# Altium schematic sheet Converter_Main_HV.SchDoc
size B; SheetNumber: 2; SheetTotal: 2
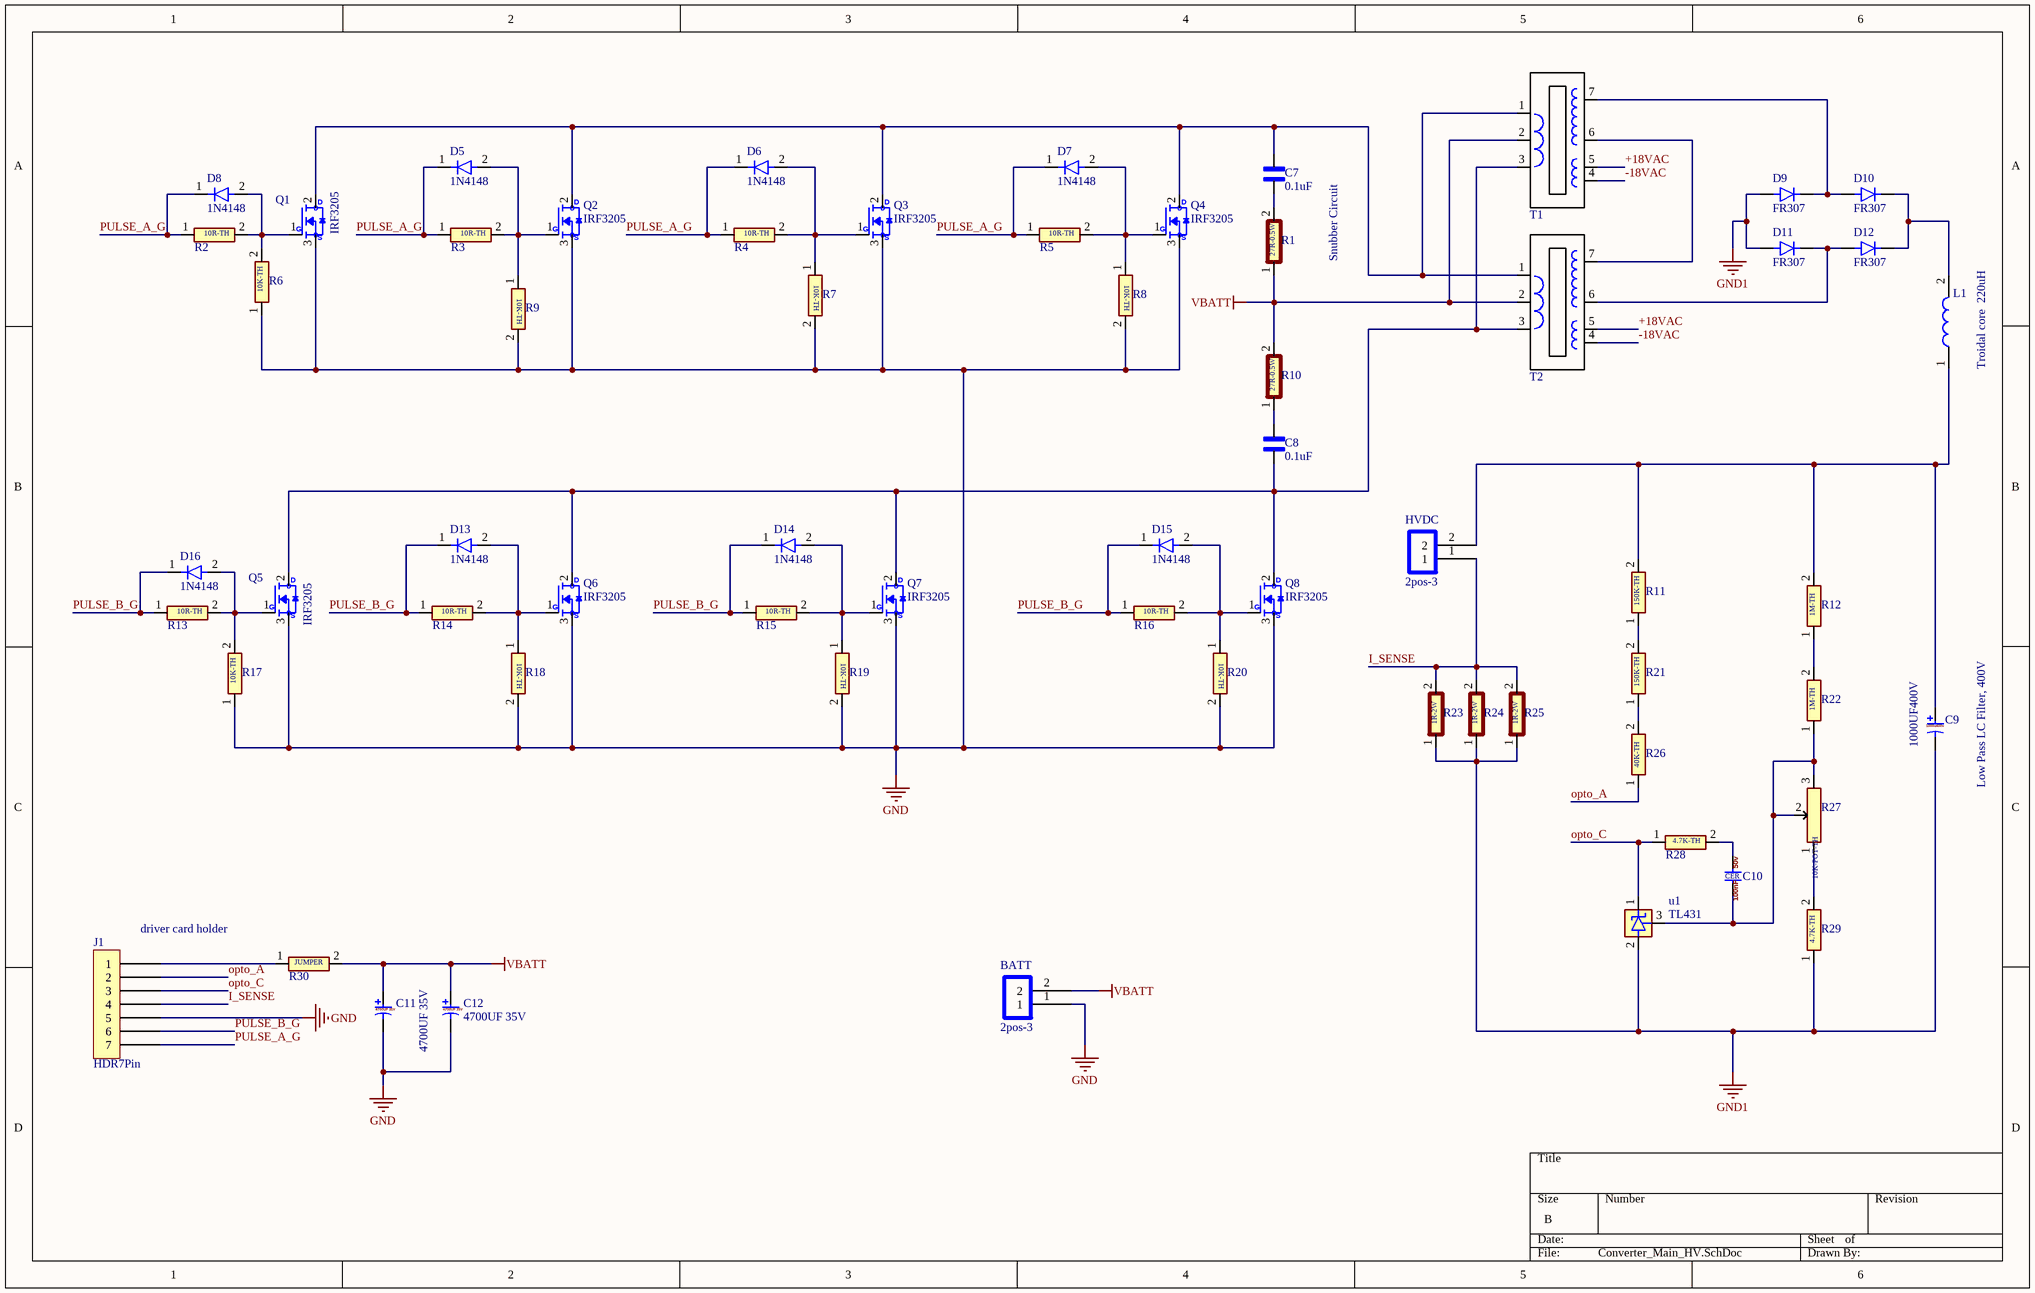
[diagram p0: Converter_Main_HV.SchDoc]

## Parts
BATT  2pos-3  [2POS - 3]
C7  0.1uF  [CAP-P_Pilm]
C8  0.1uF  [CAP-P_Pilm]
C9  1000UF400V  [CAP-TH_BD35.0-P10.00-D2.3-FD]
C10  100nFCER  [CAP-CER-2.54]  (value not drawn)
C11  4700UF 35V  [CAP-TH_BD18.0-P7.50-D1.2-FD]
C12  4700UF 35V  [CAP-TH_BD18.0-P7.50-D1.2-FD]
D5  1N4148  [DIOAD1036W78L470D235]
D6  1N4148  [DIOAD1036W78L470D235]
D7  1N4148  [DIOAD1036W78L470D235]
D8  1N4148  [DIOAD1036W78L470D235]
D9  FR307  [DO-27_BD5.3-L8.4-P12.40-D1.3-RD]
D10  FR307  [DO-27_BD5.3-L8.4-P12.40-D1.3-RD]
D11  FR307  [DO-27_BD5.3-L8.4-P12.40-D1.3-RD]
D12  FR307  [DO-27_BD5.3-L8.4-P12.40-D1.3-RD]
D13  1N4148  [DIOAD1036W78L470D235]
D14  1N4148  [DIOAD1036W78L470D235]
D15  1N4148  [DIOAD1036W78L470D235]
D16  1N4148  [DIOAD1036W78L470D235]
HVDC  2pos-3  [2POS - 3]
J1  HDR7Pin  [HDR-TH 7P - male hader]
L1  Troidal core  220uH  [TOROIDAL CORE INDUCTOR]
Q1  IRF3205  [TO-220]
Q2  IRF3205  [TO-220]
Q3  IRF3205  [TO-220]
Q4  IRF3205  [TO-220]
Q5  IRF3205  [TO-220]
Q6  IRF3205  [TO-220]
Q7  IRF3205  [TO-220]
Q8  IRF3205  [TO-220]
R1  RES-0.5W-27R  [RES_TH 3W]  (value not drawn)
R2  10R  [RES-TH-7mm]  (value not drawn)
R3  10R  [RES-TH-7mm]  (value not drawn)
R4  10R  [RES-TH-7mm]  (value not drawn)
R5  10R  [RES-TH-7mm]  (value not drawn)
R6  10K  [RES-TH-7mm]  (value not drawn)
R7  10K  [RES-TH-7mm]  (value not drawn)
R8  10K  [RES-TH-7mm]  (value not drawn)
R9  10K  [RES-TH-7mm]  (value not drawn)
R10  RES-0.5W-27R  [RES_TH 3W]  (value not drawn)
R11  150K  [RES-TH-7mm]  (value not drawn)
R12  1M  [RES-TH-7mm]  (value not drawn)
R13  10R  [RES-TH-7mm]  (value not drawn)
R14  10R  [RES-TH-7mm]  (value not drawn)
R15  10R  [RES-TH-7mm]  (value not drawn)
R16  10R  [RES-TH-7mm]  (value not drawn)
R17  10K  [RES-TH-7mm]  (value not drawn)
R18  10K  [RES-TH-7mm]  (value not drawn)
R19  10K  [RES-TH-7mm]  (value not drawn)
R20  10K  [RES-TH-7mm]  (value not drawn)
R21  150K  [RES-TH-7mm]  (value not drawn)
R22  0.5M  [RES-TH-7mm]  (value not drawn)
R23  RES-2W-1R  [RES_TH 3W]  (value not drawn)
R24  RES-2W-1R  [RES_TH 3W]  (value not drawn)
R25  RES-2W-1R  [RES_TH 3W]  (value not drawn)
R26  40K  [RES-TH-7mm]  (value not drawn)
R27  10K  [TRIM_3296W-1-250]  (value not drawn)
R28  4.7K  [RES-TH-7mm]  (value not drawn)
R29  4.7K  [RES-TH-7mm]  (value not drawn)
R30  0R  [RES-TH-7mm]  (value not drawn)
T1  current transformer  [EE35-FP16]  (value not drawn)
T2  current transformer  [EE35-FP16]  (value not drawn)
u1  TL431  [TO-92]

## Nets
GND: BATT.1 C11.2 C12.2 J1.5 Q1.3(S) Q2.3(S) Q3.3(S) Q4.3(S) Q5.3(S) Q6.3(S) Q7.3(S) Q8.3(S) R6.1 R7.2 R8.2 R9.2 R17.1 R18.2 R19.2 R20.2
GND1: C9.2 D9.A D11.A R23.1 R24.1 R25.1 R29.1 u1.2(ANODE)
VBATT: BATT.2 C11.1 C12.1 R1.1 R10.2 R30.2 T1.2 T2.2
+18VAC: T1.5 T2.5
-18VAC: T1.4 T2.4
I_SENSE: HVDC.1 J1.4 R23.2 R24.2 R25.2
opto_A: J1.2 R26.1
opto_C: J1.3 R28.1 u1.1(CATHODE)
PULSE_A_G: D5.1 D6.1 D7.1 D8.1 J1.7 R2.1 R3.1 R4.1 R5.1
PULSE_B_G: D13.1 D14.1 D15.1 D16.1 J1.6 R13.1 R14.1 R15.1 R16.1
NetC7_1: C7.1 R1.2
NetC7_2: C7.2 Q1.2(D) Q2.2(D) Q3.2(D) Q4.2(D) T1.1 T2.1
NetC8_1: C8.1 Q5.2(D) Q6.2(D) Q7.2(D) Q8.2(D) T1.3 T2.3
NetC8_2: C8.2 R10.1
NetC9_1: C9.1 HVDC.2 L1.1 R11.2 R12.2
NetC10_1: C10.1 R22.1 R27.2 R27.3 u1.3(REF)
NetC10_2: C10.2 R28.2
NetD5_2: D5.2 Q2.1(G) R3.2 R9.1
NetD6_2: D6.2 Q3.1(G) R4.2 R7.1
NetD7_2: D7.2 Q4.1(G) R5.2 R8.1
NetD8_2: D8.2 Q1.1(G) R2.2 R6.2
NetD9_C: D9.C(K) D10.A T1.7
NetD10_C: D10.C(K) D12.C(K) L1.2
NetD11_C: D11.C(K) D12.A T2.6
NetD13_2: D13.2 Q6.1(G) R14.2 R18.1
NetD14_2: D14.2 Q7.1(G) R15.2 R19.1
NetD15_2: D15.2 Q8.1(G) R16.2 R20.1
NetD16_2: D16.2 Q5.1(G) R13.2 R17.2
NetJ1_1: J1.1 R30.1
NetR11_1: R11.1 R21.2
NetR12_1: R12.1 R22.2
NetR21_1: R21.1 R26.2
NetR27_1: R27.1 R29.2
NetT1_6: T1.6 T2.7

## Notes on the sheet
- Snubber Circuit
- (near C9) Low Pass LC Filter, 400V
- driver card holder
- (in symbol 0.5M) 1M-TH
- (in symbol 0R) JUMPER
- (in symbol 1M) 1M-TH
- (in symbol 4.7K) 4.7K-TH
- (in symbol 10K) 10K-TH
- (in symbol 10K POT) 10K-POT-TH
- (in symbol 10R) 10R-TH
- (in symbol 40K) 40K-TH
- (in symbol 100nFCER) 50v; CER; 100nF
- (in symbol 150K) 150K-TH
- (in symbol 1000UF400V) 1000u400v
- (in symbol RES-0.5W-27R) 27R-0.5W
- (in symbol RES-2W-1R) 1R-2W

## Library data of the parts
BATT HVDC = 2pos-3: P2.54mm
C7 C8 = 0.1uF_film: Cap Ceramic 0.1uF 100V X7R 10% Radial 2.54mm 125Â°C T/R; MF: KYOCERA AVX; MP: SR201C104KARTR1; SnapEDA_Link: https://www.snapeda.com/parts/SR201C104KARTR1/Kyocera/view-part/?ref=snap; Package: None; Value: *; Check_prices: https://www.snapeda.com/parts/SR201C104KARTR1/Kyocera/view-part/?ref=eda
C9 = 1000UF400V: CAP TH AL: 1000U 400V; LCSC Part #: C43351; Unit Price: 0.0057
C10 = 100nFCER: CAP: CER 100nF 50V; LCSC Part #: C1848; Unit Price: 0.0104
C11 C12 = 4700UF 35V: CAP TH AL: 4700UF 35V; LCSC Part #: C43351; Unit Price: 0.0057
D5-D8 D13-D16 = 1N4148: Rectifier Diode Small Signal Switching 100V 0.3A 4ns 2-Pin DO-35 T/R; LCSC Part #: C36138; Unit Price: 0.0313
D9-D12 = FR307: DIODE: 500ns, 3A, 1000V, Fast Recovery RectifierDO-201AD TH; LCSC Part #: C36138; Unit Price: 0.0313
J1 = HDR7Pin: HEADER: 1*7P Male
L1 = Inductor: Troidal core  inductor: 220uH
Q1-Q8 = IRF3205: MOSFET: N-CH 55V 110A TO-220; LCSC Part #: C274639; Unit Price: 0.2595
R1 R10 = RES-0.5W-27R: RES: 27 OHM 1% 0.5W TH
R2-R5 R13-R16 = 10R: RES TH: 10R
R6-R9 R17-R20 = 10K: RES TH: 10K
R11 R21 = 150K: RES TH: 150K
R12 = 1M: RES TH: 1M
R22 = 0.5M: RES TH: 0.5M
R23-R25 = RES-2W-1R: RES: 1 OHM 1% 2W TH
R26 = 40K: RES TH: 40K
R27 = 10K POT: RES TH: 10K POT
R28 R29 = 4.7K: RES TH: 4.7K
R30 = 0R: RES TH: JUMPER
T1 T2 = EE42 transformer: ferrite core transformer EE42
u1 = TL431: Adjustable precision shunt regulator